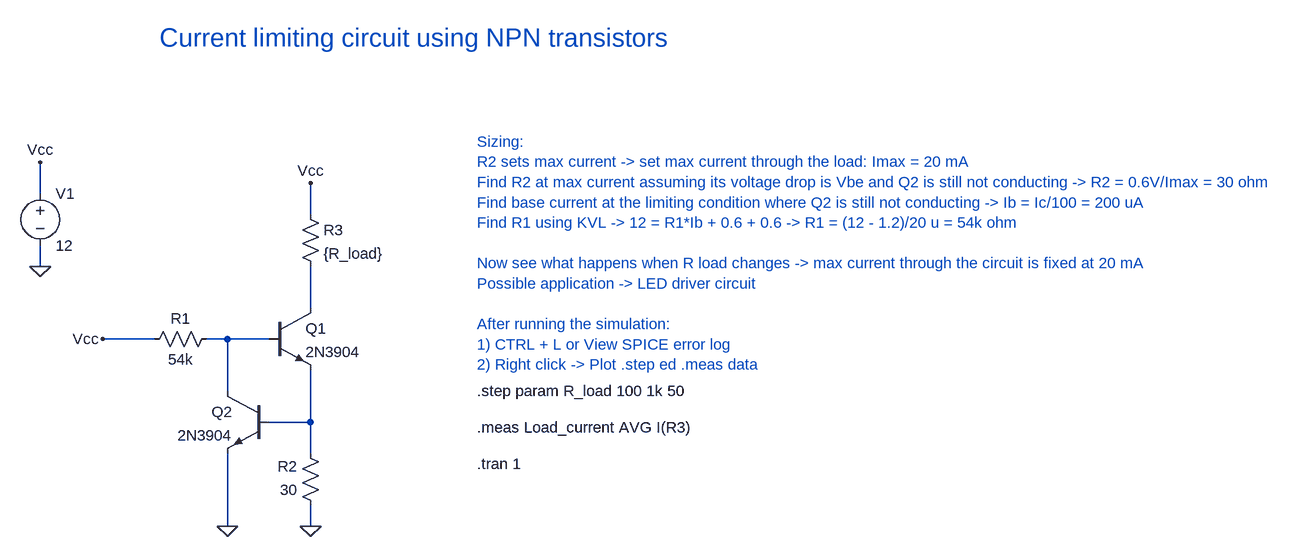
[diagram p0: schematic current-limiting-npn.asc]
current-limiting-npn.asc, the LTspice schematic file:
Version 4
SHEET 1 1828 680
WIRE -128 -48 -128 -96
WIRE 288 -16 288 -64
WIRE -128 64 -128 32
WIRE 288 128 288 64
WIRE 48 176 -32 176
WIRE 160 176 128 176
WIRE 224 176 160 176
WIRE 160 256 160 176
WIRE 288 304 288 224
WIRE 288 304 224 304
WIRE 288 352 288 304
WIRE 160 464 160 352
WIRE 288 464 288 432
FLAG 288 464 0
FLAG 160 464 0
FLAG -128 64 0
FLAG -128 -96 Vcc
FLAG 288 -64 Vcc
FLAG -32 176 Vcc
SYMBOL res 144 160 R90
WINDOW 0 0 56 VBottom 2
WINDOW 3 32 56 VTop 2
SYMATTR InstName R1
SYMATTR Value 54k
SYMBOL res 304 448 R180
WINDOW 0 36 76 Left 2
WINDOW 3 36 40 Left 2
SYMATTR InstName R2
SYMATTR Value 30
SYMBOL npn 224 128 R0
SYMATTR InstName Q1
SYMATTR Value 2N3904
SYMBOL npn 224 256 M0
SYMATTR InstName Q2
SYMATTR Value 2N3904
SYMBOL voltage -128 -64 R0
WINDOW 123 0 0 Left 0
WINDOW 39 0 0 Left 0
SYMATTR InstName V1
SYMATTR Value 12
SYMBOL res 272 -32 R0
SYMATTR InstName R3
SYMATTR Value {R_load}
TEXT 544 -128 Left 2 ;Sizing:\nR2 sets max current -> set max current through the load: Imax = 20 mA\nFind R2 at max current assuming its voltage drop is Vbe and Q2 is still not conducting -> R2 = 0.6V/Imax = 30 ohm\nFind base current at the limiting condition where Q2 is still not conducting -> Ib = Ic/100 = 200 uA\nFind R1 using KVL -> 12 = R1*Ib + 0.6 + 0.6 -> R1 = (12 - 1.2)/20 u = 54k ohm\n \nNow see what happens when R load changes -> max current through the circuit is fixed at 20 mA\nPossible application -> LED driver circuit\n \nAfter running the simulation:\n1) CTRL + L or View SPICE error log\n2) Right click -> Plot .step ed .meas data
TEXT 544 368 Left 2 !.tran 1
TEXT 544 256 Left 2 !.step param R_load 100 1k 50
TEXT 544 312 Left 2 !.meas Load_current AVG I(R3)
TEXT 56 -288 Left 4 ;Current limiting circuit using NPN transistors

The netlist it stands for:
* current-limiting-npn.asc
R1 N002 Vcc 54k
R2 0 N003 30
Q1 N001 N002 N003 0 2N3904
Q2 N002 N003 0 0 2N3904
V1 Vcc 0 12
R3 Vcc N001 {R_load}
.model NPN NPN
.model PNP PNP
.lib standard.bjt
* Sizing:
* R2 sets max current -> set max current through the load: Imax = 20 mA
* Find R2 at max current assuming its voltage drop is Vbe and Q2 is still not conducting -> R2 = 0.6V/Imax = 30 ohm
* Find base current at the limiting condition where Q2 is still not conducting -> Ib = Ic/100 = 200 uA
* Find R1 using KVL -> 12 = R1*Ib + 0.6 + 0.6 -> R1 = (12 - 1.2)/20 u = 54k ohm
* Now see what happens when R load changes -> max current through the circuit is fixed at 20 mA
* Possible application -> LED driver circuit
* After running the simulation:
* 1) CTRL + L or View SPICE error log
* 2) Right click -> Plot .step ed .meas data
.tran 1
.step param R_load 100 1k 50
.meas Load_current AVG I(R3)
* Current limiting circuit using NPN transistors
.backanno
.end